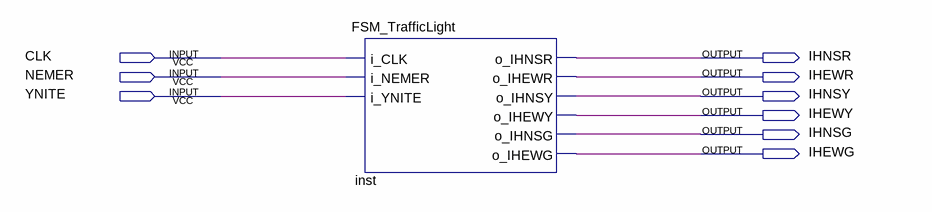
[diagram p0: schematic sheet]
// Quartus schematic FMS_TrafficLight_sch.bdf as structural Verilog: 1 symbols, 9 pins
module FMS_TrafficLight_sch (
  input  CLK,
  input  NEMER,
  input  YNITE,
  output IHNSR,
  output IHEWR,
  output IHNSY,
  output IHEWY,
  output IHNSG,
  output IHEWG
);

  FSM_TrafficLight inst (
    .i_CLK(CLK), .i_NEMER(NEMER), .i_YNITE(YNITE), .o_IHNSR(IHNSR), .o_IHEWR(IHEWR), .o_IHNSY(IHNSY),
    .o_IHEWY(IHEWY), .o_IHNSG(IHNSG), .o_IHEWG(IHEWG));
endmodule
